# Altium schematic sheet Interface.SchDoc
size A4; SheetNumber: 4; SheetTotal: 6
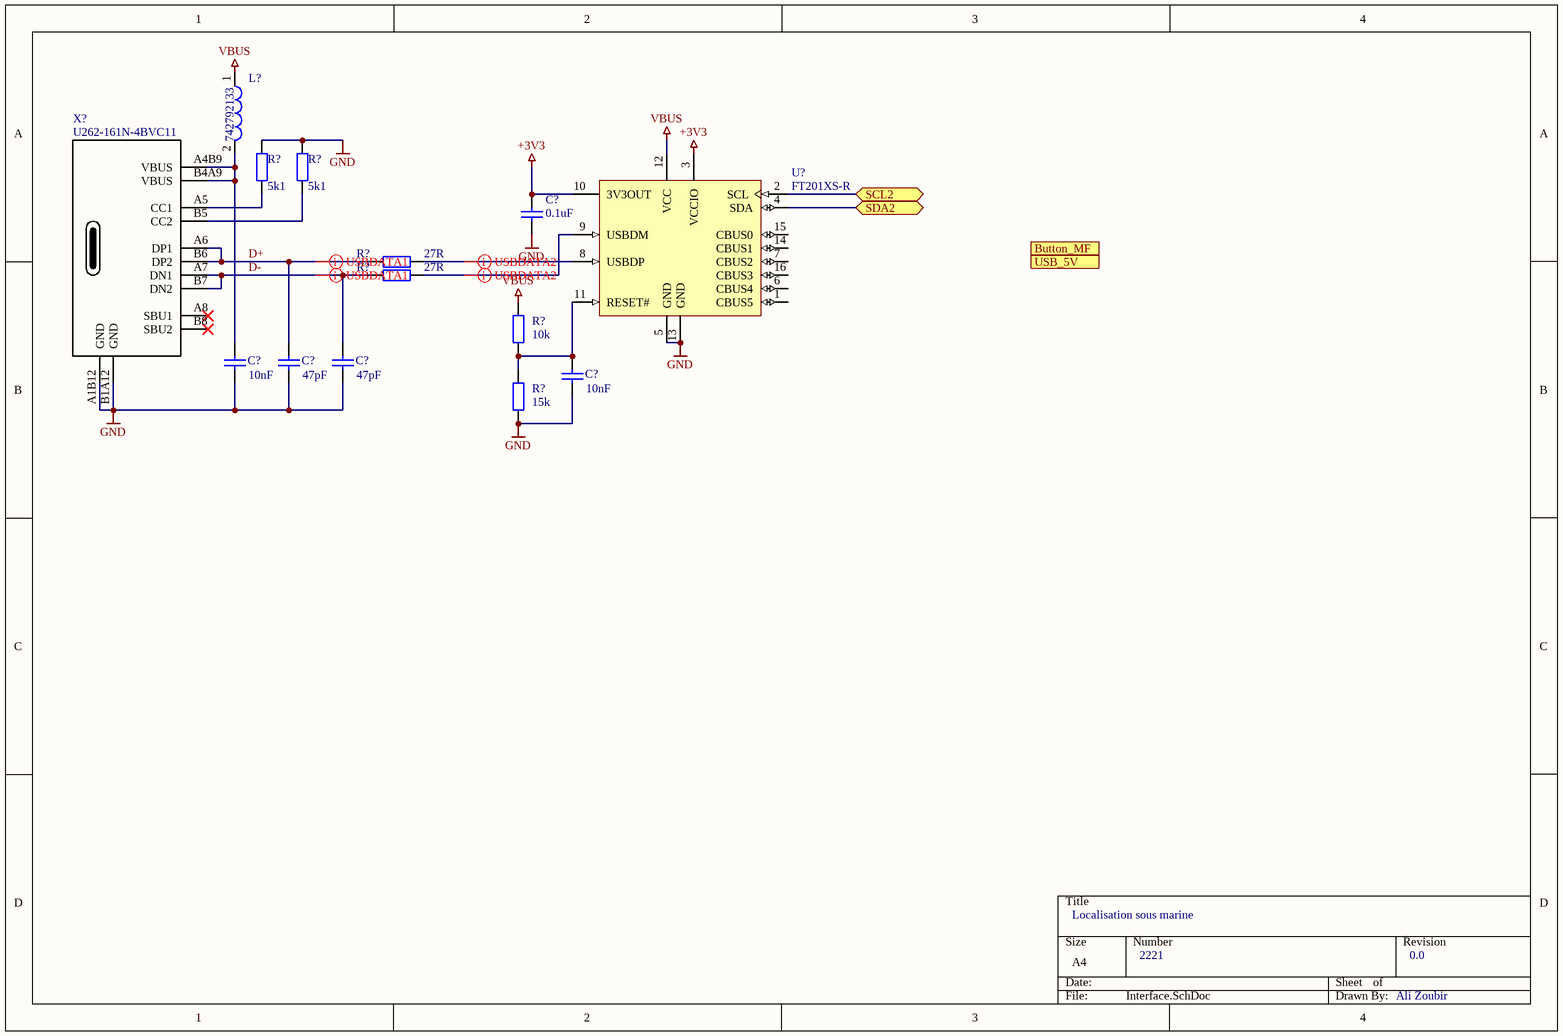
[diagram p0: Interface.SchDoc]

## Parts
(Parts that share a designator on the sheet are numbered #1, #2 ... from top to bottom, then left to right.)
C?#1  value 0.1uF  [6-0805_L]  (hidden comment: Cap)
C?#2  value 10nF  [6-0805_L]  (hidden comment: Cap)
C?#3  value 47pF  [6-0805_L]  (hidden comment: Cap)
C?#4  value 47pF  [6-0805_L]  (hidden comment: Cap)
C?#5  value 10nF  [6-0805_L]  (hidden comment: Cap)
L?  742792133  [SMD-1206]
R?#1  value 5k1  [AXIAL-0.4]  (hidden comment: Res2)
R?#2  value 5k1  [AXIAL-0.4]  (hidden comment: Res2)
R?#3  value 27R  [AXIAL-0.4]  (hidden comment: Res2)
R?#4  value 27R  [AXIAL-0.4]  (hidden comment: Res2)
R?#5  value 10k  [AXIAL-0.4]  (hidden comment: Res2)
R?#6  value 15k  [AXIAL-0.4]  (hidden comment: Res2)
U?  FT201XS-R  [SSOP-16_N]
X?  U262-161N-4BVC11  [GCT_USB4105-GF-A]

## Ports
Button_MF (out, see SchemaBloc[3B], MCU[4C]), SCL2 (bidir, see SchemaBloc[3B], MCU[4B]), SDA2 (bidir, see SchemaBloc[3B], MCU[4B]), USB_5V (out, see SchemaBloc[3B])

## Nets
+3V3: C?#1.2 U?.3(VCCIO) U?.10(3V3OUT)
GND: C?#1.1 C?#2.1 C?#3.1 C?#4.1 C?#5.1 R?#1.2 R?#2.2 R?#6.1 U?.5(GND) U?.13(GND) X?.A1B12(GND) X?.B1A12(GND)
VBUS: L?.1 R?#5.2 U?.12(VCC)
D+: C?#3.2 R?#3.1 X?.A6(DP1) X?.B6(DP2)
D-: C?#4.2 R?#4.1 X?.A7(DN1) X?.B7(DN2)
SCL2: U?.2(SCL) ; port SCL2
SDA2: U?.4(SDA) ; port SDA2
NetC?#2_2: C?#2.2 L?.2 X?.A4B9(VBUS) X?.B4A9(VBUS)
NetC?#5_2: C?#5.2 R?#5.1 R?#6.2 U?.11(RESET#)
NetR?#1_1: R?#1.1 X?.A5(CC1)
NetR?#2_1: R?#2.1 X?.B5(CC2)
NetR?#3_2: R?#3.2 U?.8(USBDP)
NetR?#4_2: R?#4.2 U?.9(USBDM)

Not connected (* = marked no-connect by the designer): U? 1(CBUS5) 6(CBUS4) 7(CBUS2) 14(CBUS1) 15(CBUS0) 16(CBUS3); X? A8(SBU1)* B8(SBU2)*

## Layout directives
differential pair: D+, D-, NetR?#3_2, NetR?#4_2

## Notes on the sheet
- Localisation sous marine
- 2221
- 0.0
- Ali Zoubir

## Library data of the parts
C?#1-C?#5 = Cap: Capacitor; Published: 8-Jun-2000; LatestRevisionDate: 17-Jul-2002; LatestRevisionNote: Re-released for DXP Platform.; PackageReference: RAD-0.3; Publisher: Altium Limited; PackageDescription: Radial Cap, Thru-Hole; 2 Leads; 0.3 in Pin Spacing
L? = CMP-0220-00010-1: SMD EMI Suppression Ferrite Bead WE-CBF, Z = 600 Ohm; Impedance: 600 Ohm; ComponentLink1Description: Manufacturer Link; DatasheetVersion: ver 2, Aug-2007; ComponentLink1URL: http://www.we-online.com; PackageDescription: Chip Inductor, 2-Leads, Body 3.2 x 1.6 mm; ComponentLink2URL: http://www.we-online.de/katalog/media/pdf/742792133.pdf; PackageVersion: 2007; PackageReference: SMD-1206; ComponentLink2Description: Datasheet
R?#1-R?#6 = Res2: Resistor; Published: 8-Jun-2000; LatestRevisionDate: 17-Jul-2002; LatestRevisionNote: Re-released for DXP Platform.; PackageReference: AXIAL-0.4; Publisher: Altium Limited; PackageDescription: Axial Device, Thru-Hole; 2 Leads; 0.4 in Pin Spacing
U? = CMP-0248-00019-2: USB to I2C Interface Slave Chip, UHCI/OHCI/EHCI Compatible, USB 2.0 Compatible, -40 to +85 degC, 16-Pin SSOP, Pb-Free, Tape and Reel; Manufacturer: FTDI; PartNumber: FT201XS-R; DatasheetVersion: ver 1.3, Feb-2013; ComponentLink1Description: Manufacturer URL; ComponentLink1URL: http://www.ftdichip.com/; PackageDescription: 16-Pin Small Outline Package, 8.6 x 3.9 mm Body, 0.635 mm Pitch; ComponentLink3URL: www.ftdichip.com/Products/ICs/FT201X.html; RevisionNote: DatasheetVersion updated to 1.3 Feb-2013; PackageReference: SSOP-16; Code_JEDEC: MO-137-AB; ComponentLink2Description: Datasheet; ComponentLink3Description: FT201X Product Page; ComponentLink2URL: http://www.ftdichip.com/Support/Documents/DataSheets/ICs/DS_FT201X.pdf; PackageVersion: Feb-13
X? = USB-C Type 2.0: U262-161N-4BVC11 / XKB Connectivity; ComponentLink1Description: LCSC  C319148; ComponentLink1URL: https://lcsc.com/product-detail/USB-Connectors_XKB-Connectivity-U262-161N-4BVC11_C319148.html; Supplier 1: LCSC; Supplier Part Number 1: C319148